# EAGLE design fb-anode (EAGLE 5.11)
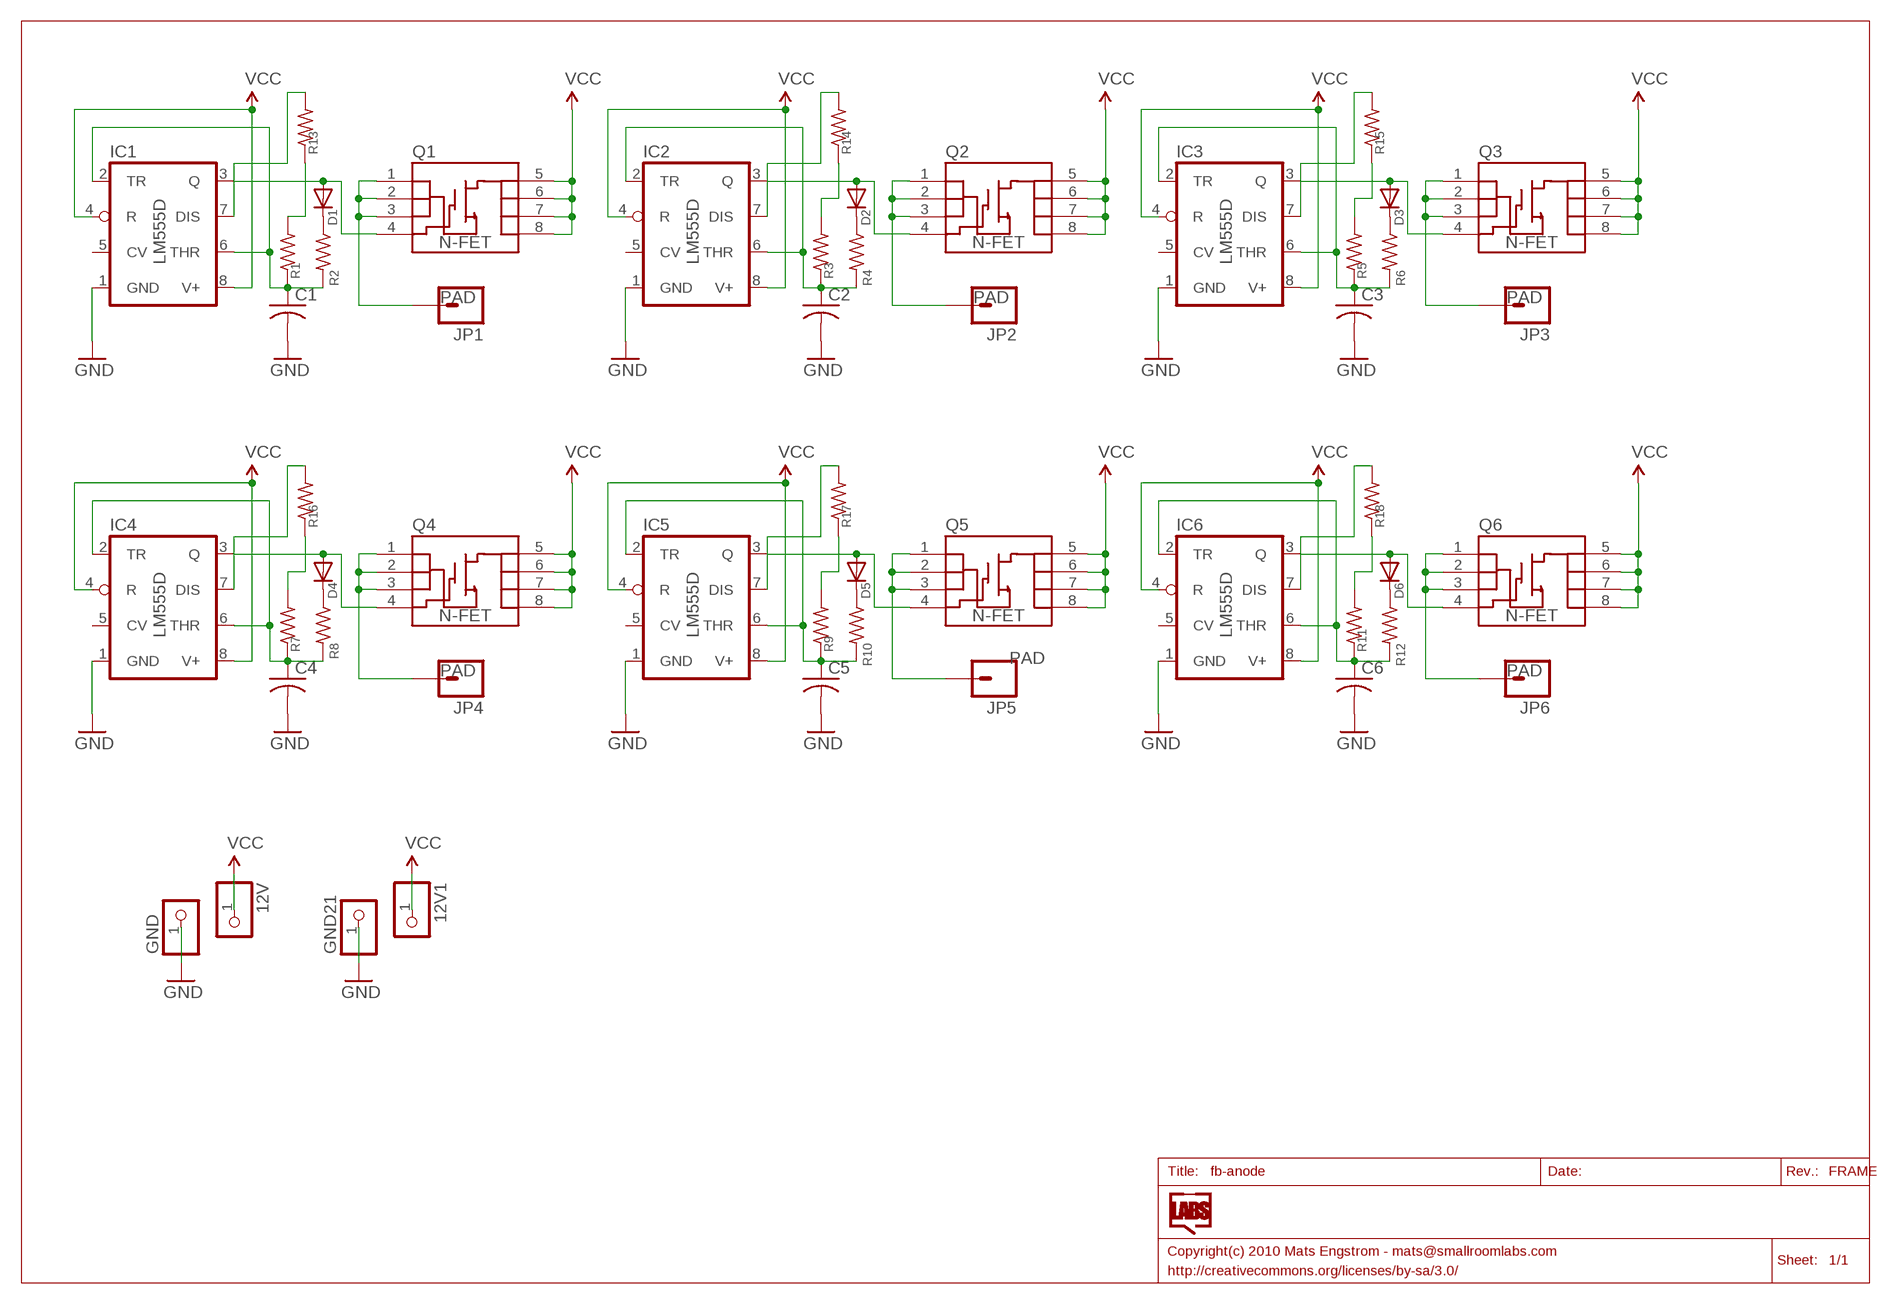
[diagram p0: schematic, sheet 1]

## Parts
12V  HEADER-1X12MM  [1X01_2MM]
12V1  HEADER-1X12MM  [1X01_2MM]
C1  C-USC1206  [C1206]
C2  C-USC1206  [C1206]
C3  C-USC1206  [C1206]
C4  C-USC1206  [C1206]
C5  C-USC1206  [C1206]
C6  C-USC1206  [C1206]
D1  DIODESMA  [SMADIODE]
D2  DIODESMA  [SMADIODE]
D3  DIODESMA  [SMADIODE]
D4  DIODESMA  [SMADIODE]
D5  DIODESMA  [SMADIODE]
D6  DIODESMA  [SMADIODE]
GND  HEADER-1X12MM  [1X01_2MM]
GND21  HEADER-1X12MM  [1X01_2MM]
IC1  LM555D  [SO08]
IC2  LM555D  [SO08]
IC3  LM555D  [SO08]
IC4  LM555D  [SO08]
IC5  LM555D  [SO08]
IC6  LM555D  [SO08]
JP1  PAD  M01PTH_LONGPAD  [1X01_LONGPAD]
JP2  PAD  M01PTH_LONGPAD  [1X01_LONGPAD]
JP3  PAD  M01PTH_LONGPAD  [1X01_LONGPAD]
JP4  PAD  M01PTH_LONGPAD  [1X01_LONGPAD]
JP5  PAD  M01PTH_LONGPAD  [1X01_LONGPAD]
JP6  PAD  M01PTH_LONGPAD  [1X01_LONGPAD]
Q1  N-FET  MOSFET-NCHANNEL-SOIC8  [SO08]
Q2  N-FET  MOSFET-NCHANNEL-SOIC8  [SO08]
Q3  N-FET  MOSFET-NCHANNEL-SOIC8  [SO08]
Q4  N-FET  MOSFET-NCHANNEL-SOIC8  [SO08]
Q5  N-FET  MOSFET-NCHANNEL-SOIC8  [SO08]
Q6  N-FET  MOSFET-NCHANNEL-SOIC8  [SO08]
R1  R-US_R0805W  [R0805W]
R2  R-US_R0805W  [R0805W]
R3  R-US_R0805W  [R0805W]
R4  R-US_R0805W  [R0805W]
R5  R-US_R0805W  [R0805W]
R6  R-US_R0805W  [R0805W]
R7  R-US_R0805W  [R0805W]
R8  R-US_R0805W  [R0805W]
R9  R-US_R0805W  [R0805W]
R10  R-US_R0805W  [R0805W]
R11  R-US_R0805W  [R0805W]
R12  R-US_R0805W  [R0805W]
R13  R-US_R0805W  [R0805W]
R14  R-US_R0805W  [R0805W]
R15  R-US_R0805W  [R0805W]
R16  R-US_R0805W  [R0805W]
R17  R-US_R0805W  [R0805W]
R18  R-US_R0805W  [R0805W]

## Nets
GND [power]: C1.2 C2.2 C3.2 C4.2 C5.2 C6.2 GND21.1 GND.1 IC1.1(GND) IC2.1(GND) IC3.1(GND) IC4.1(GND) IC5.1(GND) IC6.1(GND)
N$1: C1.1 IC1.2(TR) IC1.6(THR) R1.1 R2.2
N$3: IC1.7(DIS) R13.2
N$4: D1.C R2.1
N$5: C2.1 IC2.2(TR) IC2.6(THR) R3.1 R4.2
N$6: D1.A IC1.3(Q) Q1.4(G)
N$8: IC3.7(DIS) R15.2
N$9: D2.A IC2.3(Q) Q2.4(G)
N$10: D2.C R4.1
N$11: C3.1 IC3.2(TR) IC3.6(THR) R5.1 R6.2
N$13: R5.2 R15.1
N$14: D3.A IC3.3(Q) Q3.4(G)
N$15: D3.C R6.1
N$16: C4.1 IC4.2(TR) IC4.6(THR) R7.1 R8.2
N$18: IC6.7(DIS) R18.2
N$19: D4.A IC4.3(Q) Q4.4(G)
N$20: D4.C R8.1
N$21: C5.1 IC5.2(TR) IC5.6(THR) R9.1 R10.2
N$23: R11.2 R18.1
N$24: D5.A IC5.3(Q) Q5.4(G)
N$25: D5.C R10.1
N$26: C6.1 IC6.2(TR) IC6.6(THR) R11.1 R12.2
N$28: IC5.7(DIS) R17.2
N$29: D6.A IC6.3(Q) Q6.4(G)
N$30: D6.C R12.1
N$31: R1.2 R13.1
N$32: IC2.7(DIS) R14.2
N$33: R3.2 R14.1
N$34: R9.2 R17.1
N$35: IC4.7(DIS) R16.2
N$36: R7.2 R16.1
N$37 [power]: JP2.1 Q2.1(S) Q2.2(S) Q2.3(S)
N$38 [power]: JP1.1 Q1.1(S) Q1.2(S) Q1.3(S)
N$39 [power]: JP3.1 Q3.1(S) Q3.2(S) Q3.3(S)
N$40 [power]: JP6.1 Q6.1(S) Q6.2(S) Q6.3(S)
N$41 [power]: JP5.1 Q5.1(S) Q5.2(S) Q5.3(S)
N$42 [power]: JP4.1 Q4.1(S) Q4.2(S) Q4.3(S)
VCC [power]: 12V1.1 12V.1 IC1.4(R) IC1.8(V+) IC2.4(R) IC2.8(V+) IC3.4(R) IC3.8(V+) IC4.4(R) IC4.8(V+) IC5.4(R) IC5.8(V+) IC6.4(R) IC6.8(V+) Q1.5(D) Q1.6(D) Q1.7(D) Q1.8(D) Q2.5(D) Q2.6(D) Q2.7(D) Q2.8(D) Q3.5(D) Q3.6(D) Q3.7(D) Q3.8(D) Q4.5(D) Q4.6(D) Q4.7(D) Q4.8(D) Q5.5(D) Q5.6(D) Q5.7(D) Q5.8(D) Q6.5(D) Q6.6(D) Q6.7(D) Q6.8(D)
Unconnected: IC1.5(CV) IC2.5(CV) IC3.5(CV) IC4.5(CV) IC5.5(CV) IC6.5(CV)

## Library data of the parts
12V 12V1 GND GND21 = microbuilder:HEADER-1X1: PIN HEADER
C1-C6 = adafruit:C-US: CAPACITOR, American symbol
D1-D6 = adafruit:DIODE: Diode SMADIODE - SMA Surface Mount Package 20V 1A Schottky Diode Digikey: 641-1014-6-ND DO-1N4148 - Through Hole Small Current Diode SOD-123 20V 1 A (.5mV Vf) Schottky Diode - Digikey: MBRX120TPMSCT-ND SOD-323 10V 570mA (.38mV Vf, 3ns) Schottky Diode - Digikey: ZLLS410CT-ND SOD-523 30V 30mA Schottky Diode (RB751S-40TE61) - Digikey: RB751S-40TE61CT-ND SOT23-R/W - SOT23 Package (R = Solder Paste/Reflow Ovens, W = Hand-Soldering) BAT54Film 40V 300mA - Digikey: 497-7162-1-ND
IC1-IC6 = adafruit:*555: TIMER Changed DIP package to have round (not oval) pin pads http://www.ladyada.net/library/pcb/eaglelibrary.html
JP1-JP6 = SparkFun:M01: Header 1 Standard 1-pin 0.1" header. Use with straight break away headers (SKU : PRT-00116), right angle break away headers (PRT-00553), swiss pins (PRT-00743), machine pins (PRT-00117), and female headers (PRT-00115).
Q1-Q6 = SparkFun:MOSFET-NCHANNEL-SOIC8: N-Channel MOSFET IRF9410 and NDS8434 are common, SOIC-8 parts.
R1-R18 = adafruit:R-US_: RESISTOR, American symbol

## Net classes
0 default: width 0.406 mm, clearance 0.305 mm
1 power: width 0.406 mm, clearance 0.305 mm

## Board
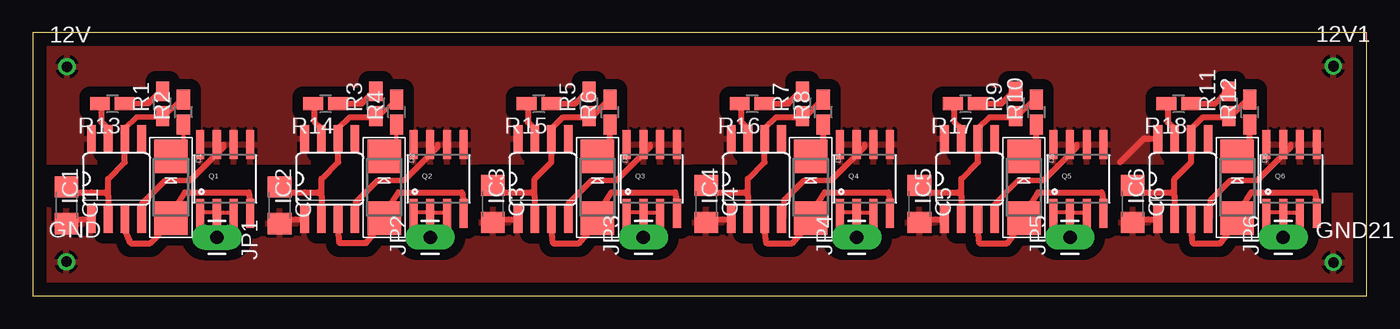
[diagram p1: board, top side]

Size 101.26 x 19.99 mm. Coordinates in mm from the lower left corner, seen from the top.
Outline: 0,0 101.26,0 101.26,19.99 0,19.99 0,0
Copper layers (1*16): Top 0.035mm / dielectric 1.5mm / Bottom 0.035mm
Design rules "default": minimum track width 10mil, minimum drill 0.6mm, track to track 8mil, track to pad 8mil, pad to pad 8mil, via to via 8mil, smd to smd 8mil, copper to edge 40mil, drill to drill 8mil, minimum pad ring 10mil, minimum via ring 8mil, stop-mask expansion 4mil, vias tented up to drill 0mil, thermal gap 10mil

### Footprints (pad centres in the part's own frame; a part is rotated, then mirrored left to right if it is on the bottom)
1X01_2MM = drill 0.8 pad 1.27 round: 1 0,0
C1206 = smd 1.6 x 1.8: 1 -1.4,0; 2 1.4,0
SMADIODE = smd 2.54 x 2.54: A 2.349,0; C -2.349,0
SO08 = smd 0.66 x 2.032: 1 -1.905,-3.073; 2 -0.635,-3.073; 3 0.635,-3.073; 4 1.905,-3.073; 5 1.905,3.073; 6 0.635,3.073; 7 -0.635,3.073; 8 -1.905,3.073
1X01_LONGPAD = drill 1.016 pad 1.88 long: 1 0,0
SO08' = smd 0.61 x 2.21: 1 -1.905,-2.616; 2 -0.635,-2.616; 3 0.635,-2.616; 4 1.905,-2.616; 5 1.905,2.616; 6 0.635,2.616; 7 -0.635,2.616; 8 -1.905,2.616
R0805W = smd 1.5 x 1: 1 -0.94,0; 2 0.94,0

### Placement (x,y rotation side)
12V  2.59,17.41 0 top
12V1  98.74,17.46 0 top
C1  2.54,6.89 270 top
C2  18.73,6.89 270 top
C3  34.92,6.99 270 top
C4  51.12,6.99 270 top
C5  67.31,6.99 270 top
C6  83.5,6.99 270 top
D1  10.48,8.26 270 top
D2  26.67,8.26 270 top
D3  42.86,8.26 270 top
D4  59.05,8.26 270 top
D5  75.25,8.26 270 top
D6  91.44,8.26 270 top
GND  2.54,2.59 0 top
GND21  98.74,2.54 0 top
IC1  6.35,8.89 0 top
IC2  22.54,8.89 0 top
IC3  38.73,8.89 0 top
IC4  54.93,8.89 0 top
IC5  71.12,8.89 0 top
IC6  87.31,8.89 0 top
JP1  13.97,4.45 270 top
JP2  30.16,4.45 90 top
JP3  46.35,4.45 90 top
JP4  62.55,4.45 90 top
JP5  78.74,4.45 90 top
JP6  94.93,4.45 90 top
Q1  N-FET  [SO08']  14.61,8.89 0 top
Q2  N-FET  [SO08']  30.8,8.89 0 top
Q3  N-FET  [SO08']  46.99,8.89 0 top
Q4  N-FET  [SO08']  63.18,8.89 0 top
Q5  N-FET  [SO08']  79.38,8.89 0 top
Q6  N-FET  [SO08']  95.57,8.89 0 top
R1  9.84,14.61 90 top
R2  11.43,13.97 90 top
R3  26.04,14.61 90 top
R4  27.62,13.97 90 top
R5  42.23,14.61 90 top
R6  43.81,13.97 90 top
R7  58.42,14.61 90 top
R8  60.01,13.97 90 top
R9  74.61,14.61 90 top
R10  76.2,13.97 90 top
R11  90.81,14.61 90 top
R12  92.39,13.97 90 top
R13  6.03,14.61 180 top
R14  22.23,14.61 180 top
R15  38.42,14.61 180 top
R16  54.61,14.61 180 top
R17  70.8,14.61 180 top
R18  87,14.61 180 top

### Tracks (layer width: path | path; a pad name or v marks a point on that pad's centre or on a via)
GND
  Top 0.457: IC1.1 2.87,5.82 C1.2 | IC2.1 19.06,5.82 C2.2 | IC3.1 35.16,5.82 C3.2 | IC4.1 51.35,5.82 C4.2 | IC5.1 67.54,5.82 C5.2 | IC6.1 83.73,5.82 C6.2
  pour Top (isolate 0.813): -1.27,7.62 102.55,7.62 102.55,-2.54 -1.27,-2.54
N$1
  Top 0.305: 5.71,6.6 5.71,6.35 5.71,5.84 IC1.2 | C1.1 2.54,7.87 | 6.99,12.7 6.99,12.06 IC1.6 | 9.78,13.59 R1.1 9.91,13.59 | 11.18,14.86 11.43,14.86 R2.2
  Top 0.406: 6.99,12.7 7.87,13.59 9.78,13.59 | 9.91,13.59 11.18,14.86
  Top 0.457: 2.54,7.87 4.45,7.87 5.46,7.87 5.71,7.62 | IC1.6 6.99,10.16 5.71,8.89 5.71,7.62 | 5.71,7.62 5.71,6.35
N$3
  Top 0.305: 5.71,12.06 5.71,12.7 | 5.21,14.61 R13.2
  Top 0.457: 5.21,14.61 5.21,13.21 5.71,12.7 | IC1.7 5.71,12.06
N$4
  Top 0.305: R2.1 11.43,12.32 11.43,10.92 10.54,10.03 D1.C
N$5
  Top 0.305: 21.91,6.6 21.91,6.35 21.91,5.84 IC2.2 | C2.1 18.73,7.87 | R4.2 27.62,14.99 26.35,13.72 26.1,13.72 R3.1 25.97,13.59 | 23.18,12.7 23.18,12.06 IC2.6
  Top 0.457: 18.73,7.87 20.64,7.87 21.65,7.87 21.91,7.62 | 23.18,12.7 24.07,13.59 25.97,13.59 | IC2.6 23.18,10.16 21.91,8.89 21.91,7.62 | 21.91,7.62 21.91,6.35
N$6
  Top 0.305: 6.99,5.08 6.99,5.71 IC1.3 | 10.1,5.21 D1.A 10.54,5.33 10.54,6.22 | 16.51,7.11 16.51,6.35 Q1.4
  Top 0.457: 6.99,5.08 7.43,4 8.89,4 10.1,5.21 | 16.51,7.11 16.38,7.87 11.56,7.87 10.54,6.22
N$8
  Top 0.305: R15.2 37.59,14.61
  Top 0.457: 37.59,14.61 37.59,13.21 38.1,12.7 38.1,12.06 IC3.7
N$9
  Top 0.305: 23.18,5.08 23.18,5.71 IC2.3 | 26.92,5.97 D2.A 26.61,6.1 | 32.7,7.11 32.7,6.35 Q2.4
  Top 0.457: 23.18,5.08 23.3,4 25.27,4 26.92,5.97 | 32.7,7.11 32.58,7.87 27.75,7.87 26.61,6.1
N$10
  Top 0.305: R4.1 27.62,12.95 27.62,11.56 26.73,10.67 D2.C
N$11
  Top 0.305: 38.1,6.6 38.1,6.35 38.1,5.84 IC3.2 | C3.1 34.92,7.87 | 42.55,13.72 42.29,13.72 R5.1 42.16,13.59 | 43.81,14.99 R6.2 | IC3.6 39.37,12.06
  Top 0.457: 34.92,7.87 36.83,7.87 37.85,7.87 38.1,7.62 | 42.55,13.72 43.81,14.99 | 39.37,12.06 39.37,12.7 40.26,13.59 42.16,13.59 | IC3.6 39.37,10.16 38.1,8.89 38.1,7.62 | 38.1,7.62 38.1,6.35
N$13
  Top 0.305: R15.1 | 42.16,15.62 R5.2
  Top 0.457: R15.1 41.15,14.61 42.16,15.62
N$14
  Top 0.305: 39.37,5.08 39.37,5.71 IC3.3 | 43.12,5.97 D3.A 42.8,6.1 | 48.9,7.11 48.9,6.35 Q3.4
  Top 0.457: 39.37,5.08 39.5,4 41.47,4 43.12,5.97 | 48.9,7.11 48.77,7.87 43.94,7.87 42.8,6.1
N$15
  Top 0.305: D3.C 42.93,10.67
  Top 0.457: 42.93,10.67 43.81,11.56 43.81,12.95 R6.1
N$16
  Top 0.305: 54.29,6.6 54.29,5.84 IC4.2 | C4.1 51.12,7.87 | 58.74,13.72 58.48,13.72 R7.1 | 60.01,14.99 R8.2 | IC4.6 55.56,12.06
  Top 0.457: 51.12,7.87 53.02,7.87 54.04,7.87 54.29,7.62 | 58.74,13.72 60.01,14.99 | 55.56,12.06 55.56,12.7 56.45,13.59 58.36,13.59 R7.1 | IC4.6 55.56,10.16 54.29,8.89 54.29,7.62 | 54.29,7.62 IC4.2
N$18
  Top 0.305: 86.68,12.7 86.68,12.06 | R18.2 86.17,14.61
  Top 0.457: 86.17,14.61 86.17,13.21 86.68,12.7 | 86.68,12.06 IC6.7
N$19
  Top 0.305: 55.56,5.08 55.56,5.71 IC4.3 | 59.31,5.97 D4.A 58.99,6.1 | 65.09,7.11 65.09,6.35 Q4.4
  Top 0.457: 55.56,5.08 55.69,4 57.66,4 59.31,5.97 | 65.09,7.11 64.96,7.87 60.13,7.87 58.99,6.1
N$20
  Top 0.305: 60.01,11.56 59.12,10.67 D4.C | 60.01,12.95 R8.1
  Top 0.457: 60.01,11.56 60.01,12.95
N$21
  Top 0.305: 70.48,6.6 70.48,5.84 IC5.2 | C5.1 67.31,7.87 | 74.55,13.59 R9.1 74.68,13.59 | 75.95,14.86 76.2,14.86 R10.2
  Top 0.457: 67.31,7.87 69.22,7.87 70.23,7.87 70.48,7.62 | 74.55,13.59 72.64,13.59 71.75,12.7 71.75,12.06 IC5.6 71.75,10.16 70.48,8.89 70.48,7.62 | 70.48,7.62 IC5.2 | 74.68,13.59 75.95,14.86
N$23
  Top 0.305: R18.1
  Top 0.457: R18.1 89.72,14.61 90.74,15.62 R11.2
N$24
  Top 0.305: 71.75,5.08 71.75,5.71 IC5.3 | 74.87,5.21 D5.A | 81.28,7.11 81.28,6.35 Q5.4 | 75.31,5.33 75.31,6.22
  Top 0.457: 71.75,5.08 71.88,4 73.98,4 74.87,5.21 | 81.28,7.11 81.15,7.87 76.33,7.87 75.31,6.22 | D5.A 75.31,5.33
N$25
  Top 0.305: 76.2,10.92 75.31,10.03 D5.C
  Top 0.457: 76.2,10.92 76.2,12.32 R10.1
N$26
  Top 0.305: 86.68,6.6 86.68,6.35 86.68,5.84 IC6.2 | C6.1 83.5,7.87 | IC6.6 87.95,12.06 | 90.74,13.59 R11.1 90.87,13.59 | 92.14,14.86 92.39,14.86 R12.2
  Top 0.457: 83.5,7.87 85.41,7.87 86.42,7.87 86.68,7.62 | 87.95,12.06 87.95,12.7 88.84,13.59 90.74,13.59 | IC6.6 87.95,10.16 86.68,8.89 86.68,7.62 | 86.68,7.62 86.68,6.35 | 90.87,13.59 92.14,14.86
N$28
  Top 0.305: 69.98,14.61 R17.2
  Top 0.457: 69.98,14.61 69.98,13.21 70.48,12.7 70.48,12.06 IC5.7
N$29
  Top 0.305: 87.95,5.71 IC6.3 | 91.06,5.21 D6.A 91.5,5.33 91.5,6.22 | 97.47,7.11 97.47,6.35 Q6.4
  Top 0.457: 87.95,5.71 87.95,5.08 88.08,4 90.17,4 91.06,5.21 | 97.47,7.11 97.35,7.87 92.52,7.87 91.5,6.22
N$30
  Top 0.305: 92.39,10.92 91.5,10.03 D6.C
  Top 0.457: 92.39,10.92 92.39,12.32 R12.1
N$31
  Top 0.305: R13.1 6.99,14.61 | 9.78,15.62 R1.2
  Top 0.406: 6.99,14.61 8.76,14.61 9.78,15.62
N$32
  Top 0.305: 21.91,12.7 21.91,12.06 IC2.7 | 21.4,14.61 R14.2
  Top 0.457: 21.4,14.61 21.4,13.21 21.91,12.7
N$33
  Top 0.305: R14.1 | 25.97,15.62 R3.2
  Top 0.457: R14.1 24.96,14.61 25.97,15.62
N$34
  Top 0.305: R17.1 71.75,14.61 | 74.55,15.62 R9.2
  Top 0.457: 71.75,14.61 73.53,14.61 74.55,15.62
N$35
  Top 0.305: 53.78,14.61 R16.2
  Top 0.457: 53.78,14.61 53.78,13.21 54.29,12.7 54.29,12.06 IC4.7
N$36
  Top 0.305: R16.1 55.56,14.61 | 58.36,15.62 R7.2
  Top 0.457: 55.56,14.61 57.34,14.61 58.36,15.62
N$37
  Top 0.305: Q2.1 28.96,6.35 30.1,6.35 Q2.2 | Q2.3 31.37,6.35 30.23,6.35 Q2.2 | Q2.2 30.23,6.22 30.23,4.45 JP2.1
N$38
  Top 0.305: Q1.1 12.7,6.35 13.97,6.35 Q1.2 | Q1.3 15.24,6.35 14.1,6.35 Q1.2 | JP1.1 13.97,6.22 Q1.2
N$39
  Top 0.305: Q3.1 45.09,6.35 46.35,6.35 Q3.2 | Q3.3 47.62,6.35 46.48,6.35 Q3.2 | JP3.1 46.35,6.22 Q3.2
N$40
  Top 0.305: Q6.1 93.73,6.35 94.87,6.35 Q6.2 | Q6.3 96.14,6.35 95,6.35 Q6.2 | Q6.2 95,6.22 95,4.45 JP6.1
N$41
  Top 0.305: Q5.1 77.47,6.35 78.74,6.35 Q5.2 | Q5.3 80.01,6.35 78.87,6.35 Q5.2 | JP5.1 78.74,6.22 Q5.2
N$42
  Top 0.305: Q4.1 61.34,6.35 62.48,6.35 Q4.2 | Q4.3 63.75,6.35 62.61,6.35 Q4.2 | Q4.2 62.61,6.22 62.61,4.45 JP4.1
VCC
  Top 0.305: 8.26,5.84 IC1.4 8.26,5.97 | IC2.4 24.45,5.84 | IC3.4 40.64,5.84 | IC5.4 73.03,5.84 | Q2.8 28.89,11.56 | Q2.7 30.16,11.56 | Q1.8 12.7,11.56 | 13.97,11.56 Q1.7 14.1,11.56 | Q1.6 15.24,11.56 | Q3.6 47.62,11.56 | Q6.8 93.66,11.56 | Q6.7 94.93,11.56 | Q6.5 97.47,11.56 | Q6.6 96.33,11.56 | Q4.6 63.82,11.56 | Q4.7 62.67,11.56
  Top 0.406: IC1.4 8.26,6.1 8.26,6.99 10.03,8.76 11.94,8.76 14.48,11.3 14.48,11.51 | IC2.4 24.51,5.97 24.51,7.11 26.16,8.76 28.19,8.76 30.73,11.3 30.73,11.51 | IC3.4 40.64,5.97 40.64,6.99 42.42,8.76 44.32,8.76 46.86,11.3 46.86,11.51 | IC4.4 57.02,5.97 57.02,7.24 58.55,8.76 60.58,8.76 63.12,11.3 63.12,11.51 | IC5.4 73.03,5.97 73.03,6.99 74.8,8.76 76.71,8.76 79.25,11.3 79.25,11.51 | IC6.4 89.41,5.97 89.41,7.24 90.93,8.76 92.96,8.76 95.5,11.3 95.5,11.51
  Top 0.457: IC4.4 56.83,5.84 | IC6.4 89.22,5.84 | IC6.8 84.35,11.96 82.55,10.16
  pour Top (isolate 0.813): -1.27,22.86 102.55,22.86 102.55,10.16 -1.27,10.16

### Text on the board
Name: SmallRoomLabs.com